# EAGLE design V4-AddOnRaspiUART-V002 (EAGLE 9.3.0)
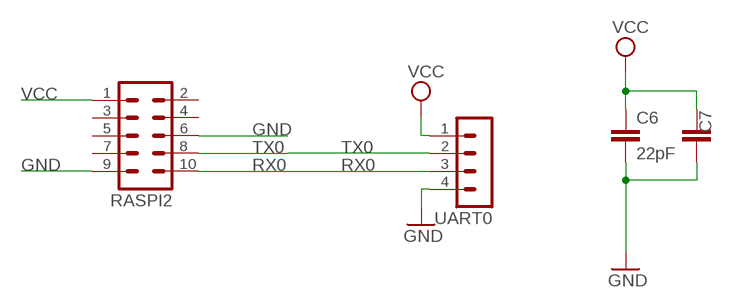
[diagram p0: schematic, sheet 1]

## Parts
C6  22pF  C-EUC0805  [C0805]
C7  C-EUC1812  [C1812]
RASPI2  MA05-2  [MA05-2]
UART0  MA04-1  [MA04-1]

## Nets
GND [PWR]: C6.2 C7.1 RASPI2.6 RASPI2.9 UART0.4
RX0: RASPI2.10 UART0.3
TX0: RASPI2.8 UART0.2
VCC [PWR]: C6.1 C7.2 RASPI2.1 UART0.1
Unconnected: RASPI2.2 RASPI2.3 RASPI2.4 RASPI2.5 RASPI2.7

## Library data of the parts
C6 C7 = rcl:C-EU: CAPACITOR, European symbol; SPICEPREFIX: C
RASPI2 = con-lstb:MA05-2: PIN HEADER; OC_FARNELL: unknown; OC_NEWARK: unknown
UART0 = con-lstb:MA04-1: PIN HEADER; OC_FARNELL: unknown; OC_NEWARK: unknown

## Net classes
0 default: width 0.305 mm
1 PWR: width 0.61 mm

## Board
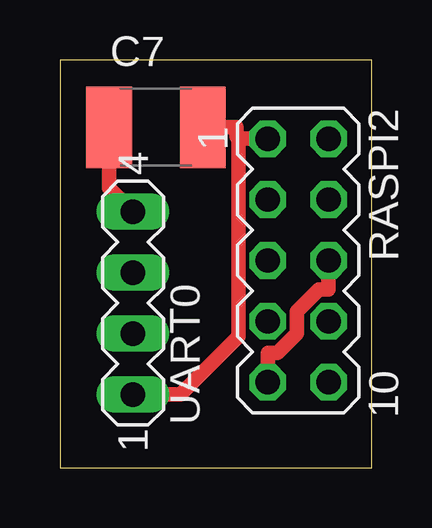
[diagram p1: board, top side]
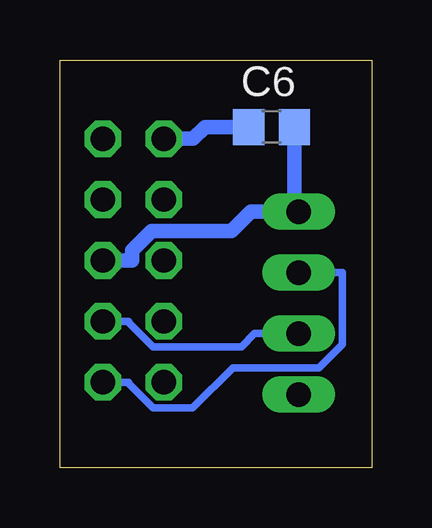
[diagram p2: board, bottom side, seen from below]

Size 13 x 17 mm. Coordinates in mm from the lower left corner, seen from the top.
Outline: 0,0 13,0 13,17 0,17 0,0
Copper layers (1*16): Top 0.035mm / dielectric 1.5mm / Bottom 0.035mm
Design rules "default": minimum track width 6mil, minimum drill 0.35mm, track to track 6mil, track to pad 6mil, pad to pad 6mil, via to via 6mil, smd to smd 6mil, copper to edge 40mil, drill to drill 6mil, minimum pad ring 10mil, minimum via ring 8mil, stop-mask expansion 4mil, vias tented up to drill 0mil, thermal gap 10mil

### Footprints (pad centres in the part's own frame; a part is rotated, then mirrored left to right if it is on the bottom)
C0805 = smd 1.3 x 1.5: 1 -0.95,0; 2 0.95,0
C1812 = smd 1.9 x 3.4: 1 -1.95,0; 2 1.95,0
MA05-2 = drill 1.016 octagon: 1 -5.08,-1.27; 2 -5.08,1.27; 3 -2.54,-1.27; 4 -2.54,1.27; 5 0,-1.27; 6 0,1.27; 7 2.54,-1.27; 8 2.54,1.27; 9 5.08,-1.27; 10 5.08,1.27
MA04-1 = drill 1.016 long: 1 -3.81,0; 2 -1.27,0; 3 1.27,0; 4 3.81,0

### Placement (x,y rotation side)
C6  4.17,14.21 0 bottom
C7  4,14.19 0 top
RASPI2  9.94,8.64 270 top
UART0  3.05,6.86 90 top

### Tracks (layer width: path | path; a pad name or v marks a point on that pad's centre or on a via)
GND
  Top 0.61: RASPI2.6 11.21,7.42 10.8,7.42 9.89,6.51 9.89,5.58 9.08,4.78 8.67,4.78 RASPI2.9 | UART0.4 2.05,11.66 C7.1
  Bottom 0.61: 3.72,10.67 3.23,11.17 C6.2 | 3.72,10.67 5.03,10.67 5.84,9.86 9.18,9.86 9.99,9.05 9.99,8.64 RASPI2.6 | UART0.4 3.72,10.67
RX0
  Bottom 0.305: RASPI2.10 10.14,3.56 10.14,3.52 9.11,2.48 7.47,2.48 5.79,4.17 2.19,4.17 1.22,5.14 1.22,8.13 UART0.3
TX0
  Bottom 0.305: RASPI2.8 10.14,6.1 10.14,6.05 9.11,5.03 5.44,5.03 4.88,5.59 UART0.2
VCC
  Top 0.61: 7.45,13.72 7.45,5.47 5.03,3.05 UART0.1 | 7.45,13.72 7.64,13.72 RASPI2.1 | 7.45,13.72 7.36,13.81 7.36,14.19 C7.2
  Bottom 0.61: RASPI2.1 7.45,13.72 6.96,14.21 C6.1